# EAGLE design pecs_storm (EAGLE 6.5.0)
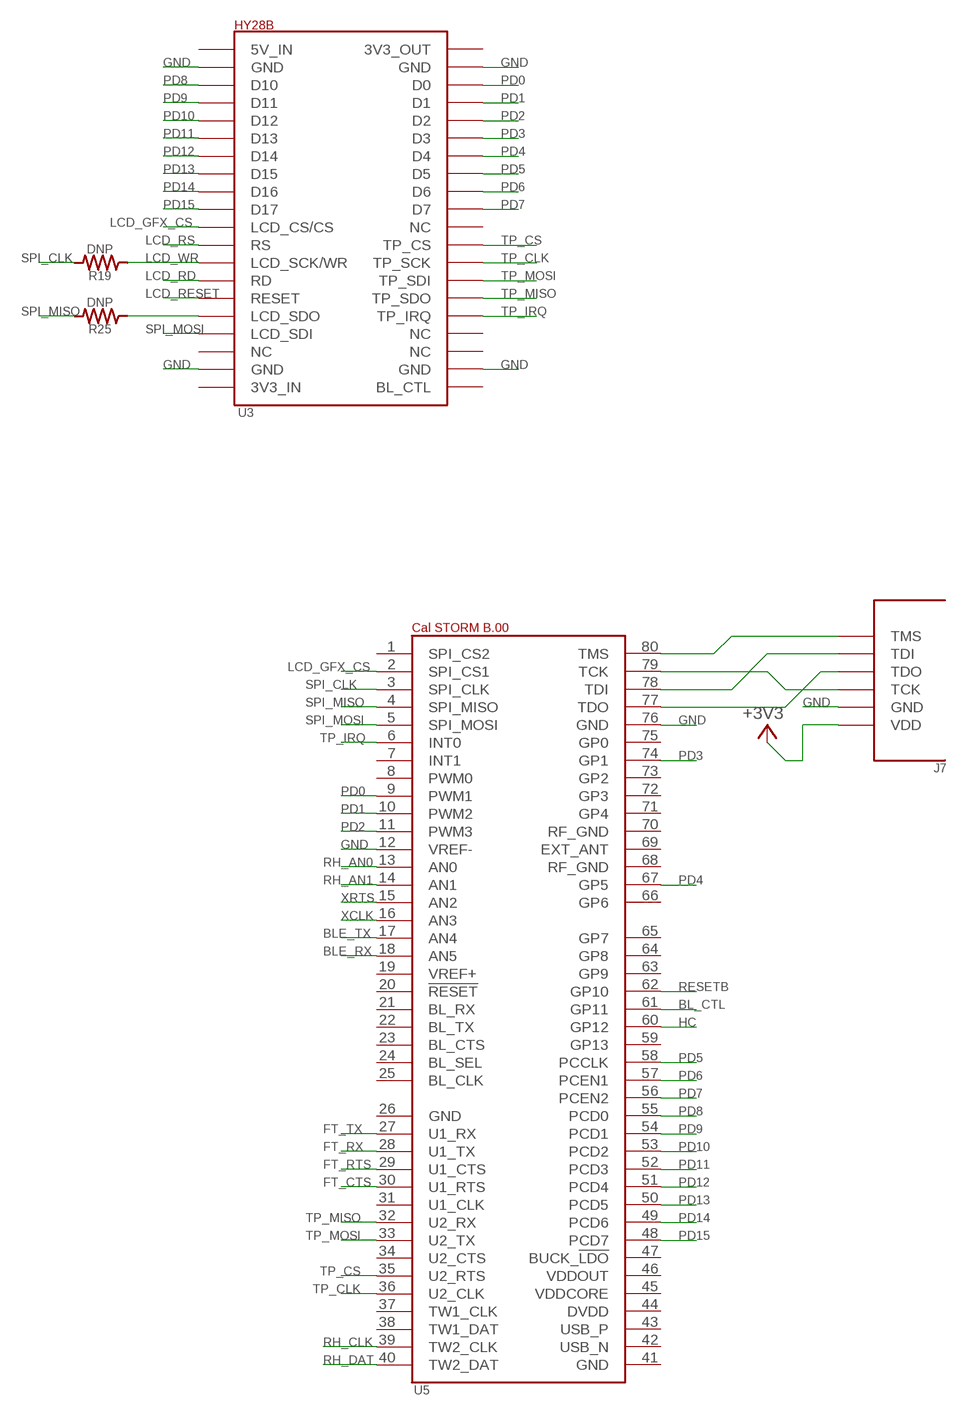
[diagram p0: schematic, sheet 1, part 1 of 2]
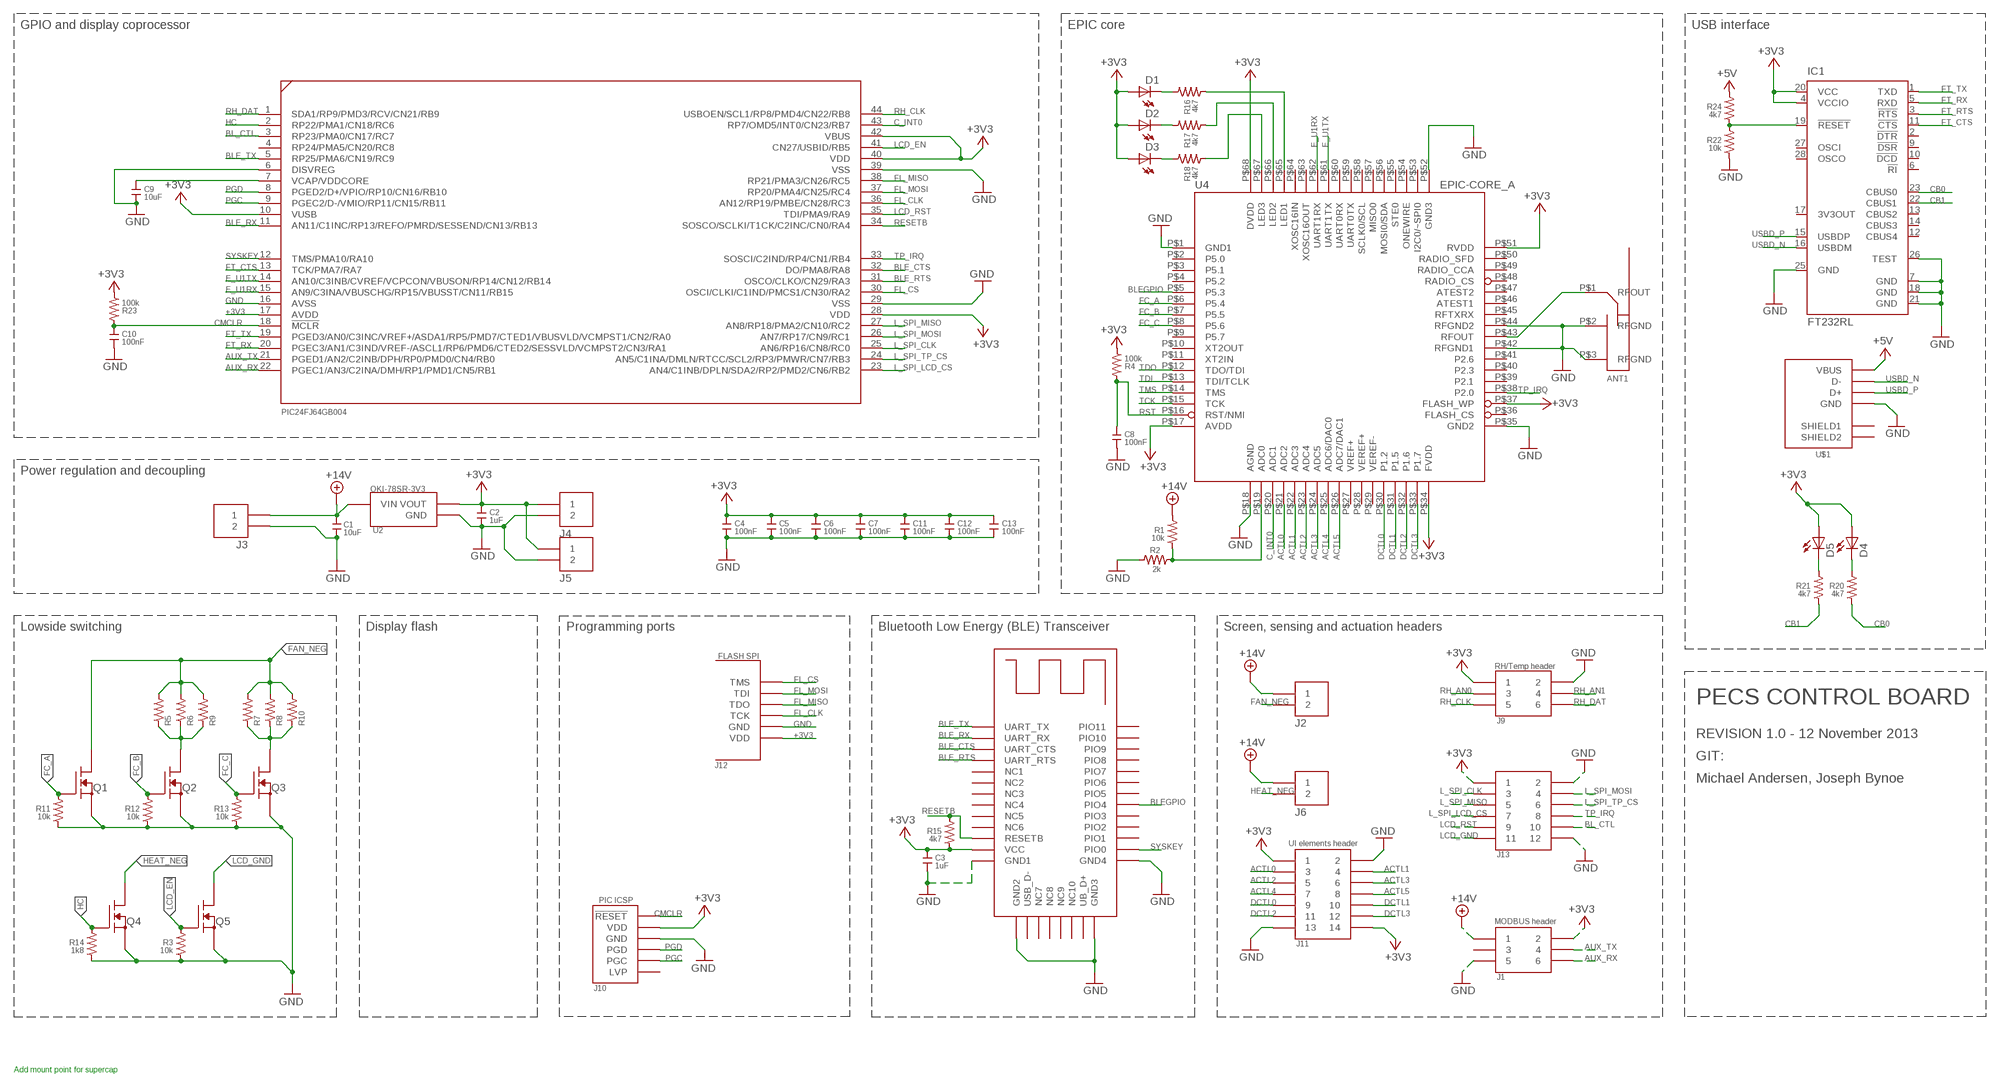
[diagram p1: schematic, sheet 1, part 2 of 2]

## Parts
ANT1  PIFA-2.4GHZ  [PIFA-2.4GHZ]
BLE1  HM10_BLE  [HM10]
C1  10uF  0805_CAPACITOR  [0805]
C2  1uF  0805_CAPACITOR  [0805]
C3  1uF  0805_CAPACITOR  [0805]
C4  100nF  0805_CAPACITOR  [0805]
C5  100nF  0805_CAPACITOR  [0805]
C6  100nF  0805_CAPACITOR  [0805]
C7  100nF  0805_CAPACITOR  [0805]
C8  100nF  0805_CAPACITOR  [0805]
C9  10uF  0805_CAPACITOR  [0805]
C10  100nF  0805_CAPACITOR  [0805]
C11  100nF  0805_CAPACITOR  [0805]
C12  100nF  0805_CAPACITOR  [0805]
C13  100nF  0805_CAPACITOR  [0805]
D1  LED1206  [LED-1206]
D2  LED1206  [LED-1206]
D3  LED1206  [LED-1206]
D4  LED1206  [LED-1206]
D5  LED1206  [LED-1206]
IC1  FT232RL  [SSOP28]
J1  HD.1-6  [HD.1-6]
J2  H.1-2  [H.1-2]
J3  H.1-2  [H.1-2]
J4  H.1-2  [H.1-2]
J5  H.1-2  [H.1-2]
J6  H.1-2  [H.1-2]
J7  JTAG  [JTAG]
J9  HD.1-6  [HD.1-6]
J10  ICSP_HDR  [H.1-6]
J11  HD.1-14  [HD.1-16]
J12  JTAG  [JTAG]
J13  HD.1-12  [HD.1-12]
Q1  NFET_DPAK  [DPAK]
Q2  NFET_DPAK  [DPAK]
Q3  NFET_DPAK  [DPAK]
Q4  NFET_DPAK  [DPAK]
Q5  NFET_DPAK  [DPAK]
R1  10k  0805_RESISTOR  [0805]
R2  2k  0805_RESISTOR  [0805]
R3  10k  0805_RESISTOR  [0805]
R4  100k  0805_RESISTOR  [0805]
R5  1206_RESISTOR  [1206]
R6  1206_RESISTOR  [1206]
R7  1206_RESISTOR  [1206]
R8  1206_RESISTOR  [1206]
R9  1206_RESISTOR  [1206]
R10  1206_RESISTOR  [1206]
R11  10k  0805_RESISTOR  [0805]
R12  10k  0805_RESISTOR  [0805]
R13  10k  0805_RESISTOR  [0805]
R14  1k8  0805_RESISTOR  [0805]
R15  4k7  0805_RESISTOR  [0805]
R16  4k7  0805_RESISTOR  [0805]
R17  4k7  0805_RESISTOR  [0805]
R18  4k7  0805_RESISTOR  [0805]
R19  DNP  0805_RESISTOR  [0805]
R20  4k7  0805_RESISTOR  [0805]
R21  4k7  0805_RESISTOR  [0805]
R22  10k  0805_RESISTOR  [0805]
R23  100k  0805_RESISTOR  [0805]
R24  4k7  0805_RESISTOR  [0805]
R25  DNP  0805_RESISTOR  [0805]
U1  PIC24FJ32GB004  [TQFP44]
U2  OKI-78SR_3V3_SMPS  [SMPS_MODULE]
U3  HY28B  [SCREEN]
U4  EPIC-CORE_A  [EPIC-LCC68]
U5  STORM_B.00  [STORM_LANDING]
U$1  USB_B  [USB_MOLEX_7041]

## Nets
+3V3: BLE1.P$12(VCC) C2.2 C3.2 C4.2 C5.2 C6.2 C7.2 C11.2 C12.2 C13.2 D1.A D2.A D3.A D4.A D5.A IC1.4(VCCIO) IC1.20(VCC) J1.P2 J4.P1 J5.P1 J7.VDD J9.P1 J10.P2(VDD) J11.P1 J11.P14 J12.VDD J13.P1 R4.1 R15.1 R23.1 U1.10(VUSB) U1.17(AVDD) U1.28(VDD) U1.40(VDD) U1.42(VBUS) U2.VOUT U4.P$17(AVDD) U4.P$34(FVDD) U4.P$37(FLASH_WP) U4.P$51(RVDD) U4.P$68(DVDD)
+5V: R24.2 U$1.1_VBUS(VBUS)
+14V: C1.2 J1.P1 J2.P1 J3.P1 J6.P1 R1.2 U2.VIN
ACTL0: J11.P3 U4.P$21(ADC2)
ACTL1: J11.P4 U4.P$22(ADC3)
ACTL2: J11.P5 U4.P$23(ADC4)
ACTL3: J11.P6 U4.P$24(ADC5)
ACTL4: J11.P7 U4.P$25(ADC6/DAC0)
ACTL5: J11.P8 U4.P$26(ADC7/DAC1)
AUX_RX: J1.P6 U1.22(PGEC1/AN3/C2INA/DMH/RP1/PMD1/CN5/RB1)
AUX_TX: J1.P4 U1.21(PGED1/AN2/C2INB/DPH/RP0/PMD0/CN4/RB0)
BL_CTL: J13.P10 U1.3(RP23/PMA0/CN17/RC7) U5.61(GP11)
BLE_CTS: BLE1.P$3(UART_CTS) U1.32(DO/PMA8/RA8)
BLE_RTS: BLE1.P$4(UART_RTS) U1.31(OSCO/CLKO/CN29/RA3)
BLE_RX: BLE1.P$2(UART_RX) U1.11(AN11/C1INC/RP13/REFO/PMRD/SESSEND/CN13/RB13) U5.18(AN5)
BLE_TX: BLE1.P$1(UART_TX) U1.5(RP25/PMA6/CN19/RC9) U5.17(AN4)
BLEGPIO: BLE1.P$27(PIO4) U4.P$5(P5.3)
C_INT0: U1.43(RP7/OMD5/INT0/CN23/RB7) U4.P$20(ADC1)
CB0: IC1.23(CBUS0) R20.1
CB1: IC1.22(CBUS1) R21.1
CMCLR: C10.2 J10.P1(!RESET!) R23.2 U1.18(!MCLR!)
DCTL0: J11.P9 U4.P$30(P1.2)
DCTL1: J11.P10 U4.P$31(P1.5)
DCTL2: J11.P11 U4.P$32(P1.6)
DCTL3: J11.P12 U4.P$33(P1.7)
E_U1RX: U1.15(AN9/C3INA/VBUSCHG/RP15/VBUSST/CN11/RB15) U4.P$62(UART1RX)
E_U1TX: U1.14(AN10/C3INB/CVREF/VCPCON/VBUSON/RP14/CN12/RB14) U4.P$61(UART1TX)
FAN_NEG: J2.P2 Q1.TAG(D) R5.2 R6.2 R7.2 R8.2 R9.2 R10.2
FC_A: Q1.P1(G) R11.2 U4.P$6(P5.4)
FC_B: Q2.P1(G) R12.2 U4.P$7(P5.5)
FC_C: Q3.P1(G) R13.2 U4.P$8(P5.6)
FL_CLK: J12.TCK U1.36(AN12/RP19/PMBE/CN28/RC3)
FL_CS: J12.TMS U1.30(OSCI/CLKI/C1IND/PMCS1/CN30/RA2)
FL_MISO: J12.TDO U1.38(RP21/PMA3/CN26/RC5)
FL_MOSI: J12.TDI U1.37(RP20/PMA4/CN25/RC4)
FT_CTS: IC1.11(!CTS) U1.13(TCK/PMA7/RA7) U5.30(U1_RTS)
FT_RTS: IC1.3(!RTS) U5.29(U1_CTS)
FT_RX: IC1.5(RXD) U1.20(PGEC3/AN1/C3IND/VREF-/ASCL1/RP6/PMD6/CTED2/SESSVLD/VCMPST2/CN3/RA1) U5.28(U1_TX)
FT_TX: IC1.1(TXD) U1.19(PGED3/AN0/C3INC/VREF+/ASDA1/RP5/PMD7/CTED1/VBUSVLD/VCMPST1/CN2/RA0) U5.27(U1_RX)
GND: ANT1.P$2(RFGND) ANT1.P$3(RFGND) BLE1.P$13(GND1) BLE1.P$14(GND2) BLE1.P$21(GND3) BLE1.P$22(GND4) C1.1 C2.1 C3.1 C4.1 C5.1 C6.1 C7.1 C8.1 C9.1 C10.1 C11.1 C12.1 C13.1 IC1.7(GND) IC1.18(GND) IC1.21(GND) IC1.25(GND) IC1.26(TEST) J1.P5 J3.P2 J4.P2 J5.P2 J7.GND J9.P2 J10.P3(GND) J11.P2 J11.P13 J12.GND J13.P2 J13.P12 Q1.P3(S) Q2.P3(S) Q3.P3(S) Q4.P3(S) Q5.P3(S) R2.1 R3.1 R11.1 R12.1 R13.1 R14.1 R22.1 U1.6(DISVREG) U1.16(AVSS) U1.29(VSS) U1.39(VSS) U2.GND U3.P$2(GND) U3.P$19(GND) U3.P$22(GND) U3.P$39(GND) U4.P$1(GND1) U4.P$18(AGND) U4.P$35(GND2) U4.P$42(RFGND1) U4.P$44(RFGND2) U4.P$52(GND3) U5.12(VREF-) U5.76(GND) U$1.4_GND(GND)
HC: Q4.P1(G) R14.2 U1.2(RP22/PMA1/CN18/RC6) U5.60(GP12)
HEAT_NEG: J6.P2 Q4.TAG(D)
L_SPI_CLK: J13.P3 U1.25(AN6/RP16/CN8/RC0)
L_SPI_LCD_CS: J13.P7 U1.23(AN4/C1INB/DPLN/SDA2/RP2/PMD2/CN6/RB2)
L_SPI_MISO: J13.P5 U1.27(AN8/RP18/PMA2/CN10/RC2)
L_SPI_MOSI: J13.P4 U1.26(AN7/RP17/CN9/RC1)
L_SPI_TP_CS: J13.P6 U1.24(AN5/C1INA/DMLN/RTCC/SCL2/RP3/PMWR/CN7/RB3)
LCD_EN: Q5.P1(G) R3.2 U1.41(CN27/USBID/RB5)
LCD_GFX_CS: U3.P$11(LCD_CS/CS) U5.2(SPI_CS1)
LCD_GND: J13.P11 Q5.TAG(D)
LCD_RD: U3.P$14(RD)
LCD_RESET: U3.P$15(RESET)
LCD_RS: U3.P$12(RS)
LCD_RST: J13.P9 U1.35(TDI/PMA9/RA9)
LCD_WR: R19.2 U3.P$13(LCD_SCK/WR)
N$1: C9.2 U1.7(VCAP/VDDCORE)
N$2: R25.2 U3.P$16(LCD_SDO)
N$3: ANT1.P$1(RFOUT) U4.P$43(RFOUT)
N$4: J7.TMS U5.80(TMS)
N$5: J7.TCK U5.79(TCK)
N$6: Q2.TAG(D) R5.1 R6.1 R9.1
N$7: Q3.TAG(D) R7.1 R8.1 R10.1
N$8: J7.TDI U5.78(TDI)
N$9: D4.C R20.2
N$10: D1.C R16.2
N$11: D2.C R17.2
N$12: D3.C R18.2
N$13: R16.1 U4.P$65(LED1)
N$14: D5.C R21.2
N$15: R17.1 U4.P$66(LED2)
N$16: R18.1 U4.P$67(LED3)
N$17: J7.TDO U5.77(TDO)
N$19: IC1.19(!RESET) R22.2 R24.1
N$23: R1.1 R2.2 U4.P$19(ADC0)
PD0: U3.P$38(D0) U5.9(PWM1)
PD1: U3.P$37(D1) U5.10(PWM2)
PD2: U3.P$36(D2) U5.11(PWM3)
PD3: U3.P$35(D3) U5.74(GP1)
PD4: U3.P$34(D4) U5.67(GP5)
PD5: U3.P$33(D5) U5.58(PCCLK)
PD6: U3.P$32(D6) U5.57(PCEN1)
PD7: U3.P$31(D7) U5.56(PCEN2)
PD8: U3.P$3(D10) U5.55(PCD0)
PD9: U3.P$4(D11) U5.54(PCD1)
PD10: U3.P$5(D12) U5.53(PCD2)
PD11: U3.P$6(D13) U5.52(PCD3)
PD12: U3.P$7(D14) U5.51(PCD4)
PD13: U3.P$8(D15) U5.50(PCD5)
PD14: U3.P$9(D16) U5.49(PCD6)
PD15: U3.P$10(D17) U5.48(PCD7)
PGC: J10.P5(PGC) U1.9(PGEC2/D-/VMIO/RP11/CN15/RB11)
PGD: J10.P4(PGD) U1.8(PGED2/D+/VPIO/RP10/CN16/RB10)
RESETB: BLE1.P$11(RESETB) R15.2 U1.34(SOSCO/SCLKI/T1CK/C2INC/CN0/RA4) U5.62(GP10)
RH_AN0: J9.P3 U5.13(AN0)
RH_AN1: J9.P4 U5.14(AN1)
RH_CLK: J9.P5 U1.44(USBOEN/SCL1/RP8/PMD4/CN22/RB8) U5.39(TW2_CLK)
RH_DAT: J9.P6 U1.1(SDA1/RP9/PMD3/RCV/CN21/RB9) U5.40(TW2_DAT)
RST: C8.2 R4.2 U4.P$16(RST/NMI)
SPI_CLK: R19.1 U5.3(SPI_CLK)
SPI_MISO: R25.1 U5.4(SPI_MISO)
SPI_MOSI: U3.P$17(LCD_SDI) U5.5(SPI_MOSI)
SYSKEY: BLE1.P$23(PIO0) U1.12(TMS/PMA10/RA10)
TCK: U4.P$15(TCK)
TDI: U4.P$13(TDI/TCLK)
TDO: U4.P$12(TDO/TDI)
TMS: U4.P$14(TMS)
TP_CLK: U3.P$28(TP_SCK) U5.36(U2_CLK)
TP_CS: U3.P$29(TP_CS) U5.35(U2_RTS)
TP_IRQ: J13.P8 U1.33(SOSCI/C2IND/RP4/CN1/RB4) U3.P$25(TP_IRQ) U4.P$38(P2.0) U5.6(INT0)
TP_MISO: U3.P$26(TP_SDO) U5.32(U2_RX)
TP_MOSI: U3.P$27(TP_SDI) U5.33(U2_TX)
USBD_N: IC1.16(USBDM) U$1.2_D-(D-)
USBD_P: IC1.15(USBDP) U$1.3_D+(D+)
XCLK: U5.16(AN3)
XRTS: U5.15(AN2)
Unconnected: BLE1.P$5(NC1) BLE1.P$6(NC2) BLE1.P$7(NC3) BLE1.P$8(NC4) BLE1.P$9(NC5) BLE1.P$10(NC6) BLE1.P$15(USB_D-) BLE1.P$16(NC7) BLE1.P$17(NC8) BLE1.P$18(NC9) BLE1.P$19(NC10) BLE1.P$20(UB_D+) BLE1.P$24(PIO1) BLE1.P$25(PIO2) BLE1.P$26(PIO3) BLE1.P$28(PIO5) BLE1.P$29(PIO6) BLE1.P$30(PIO7) BLE1.P$31(PIO8) BLE1.P$32(PIO9) BLE1.P$33(PIO10) BLE1.P$34(PIO11) IC1.2(!DTR) IC1.6(!RI) IC1.9(!DSR) IC1.10(!DCD) IC1.12(CBUS4) IC1.13(CBUS2) IC1.14(CBUS3) IC1.17(3V3OUT) IC1.27(OSCI) IC1.28(OSCO) J1.P3 J10.P6(LVP) U1.4(RP24/PMA5/CN20/RC8) U3.P$1(5V_IN) U3.P$18(NC) U3.P$20(3V3_IN) U3.P$21(BL_CTL) U3.P$23(NC) U3.P$24(NC) U3.P$30(NC) U3.P$40(3V3_OUT) U4.P$2(P5.0) U4.P$3(P5.1) U4.P$4(P5.2) U4.P$9(P5.7) U4.P$10(XT2OUT) U4.P$11(XT2IN) U4.P$27(VREF+) U4.P$28(VEREF+) U4.P$29(VEREF-) U4.P$36(FLASH_CS) U4.P$39(P2.1) U4.P$40(P2.3) U4.P$41(P2.6) U4.P$45(RFTXRX) U4.P$46(ATEST1) U4.P$47(ATEST2) U4.P$48(RADIO_CS) U4.P$49(RADIO_CCA) U4.P$50(RADIO_SFD) U4.P$53(I2C0/~SPI0) U4.P$54(ONEWIRE) U4.P$55(STE0) U4.P$56(MOSI0/SDA) U4.P$57(MISO0) U4.P$58(SCLK0/SCL) U4.P$59(UART0TX) U4.P$60(UART0RX) U4.P$63(XOSC16OUT) U4.P$64(XOSC16IN) U5.1(SPI_CS2) U5.7(INT1) U5.8(PWM0) U5.19(VREF+) U5.20(!RESET!) U5.21(BL_RX) U5.22(BL_TX) U5.23(BL_CTS) U5.24(BL_SEL) U5.25(BL_CLK) U5.26(GND) U5.31(U1_CLK) U5.34(U2_CTS) U5.37(TW1_CLK) U5.38(TW1_DAT) U5.41(GND) U5.42(USB_N) U5.43(USB_P) U5.44(DVDD) U5.45(VDDCORE) U5.46(VDDOUT) U5.47(BUCK_!LDO!) U5.59(GP13) U5.63(GP9) U5.64(GP8) U5.65(GP7) U5.66(GP6) U5.68(RF_GND) U5.69(EXT_ANT) U5.70(RF_GND) U5.71(GP4) U5.72(GP3) U5.73(GP2) U5.75(GP0) U$1.SHIELD1 U$1.SHIELD2

## Notes on the sheet
- GPIO and display coprocessor | EPIC core | USB interface
- PIC24FJ64GB004
- Power regulation and decoupling
- Lowside switching | Display flash | Programming ports | Bluetooth Low Energy (BLE) Transceiver | Screen, sensing and actuation headers
- FLASH SPI
- RH/Temp header
- PECS CONTROL BOARD
- REVISION 1.0 - 12 November 2013
- GIT:
- Michael Andersen, Joseph Bynoe
- UI elements header
- PIC ICSP
- MODBUS header
- Add mount point for supercap

## Library data of the parts
ANT1 = berkeley-epic:PIFA-2.4GHZ
BLE1 = pecs:HM10_BLE
C1-C13 = pecs:0805_CAPACITOR
D1-D5 = berkeley-epic:LED: LEDs Standard schematic elements and footprints for 5mm, 3mm, 1206, and 0603 sized LEDs. 5mm - Spark Fun Electronics SKU : COM-00529 (and others)
IC1 = ftdichip:FT232R: Source: http://www.ftdichip.com/Documents/DataSheets/DS_FT232R_v104.pdf; MPN: FT232RL; OC_FARNELL: 1146032; OC_NEWARK: 91K9918
J1 J9 = pecs:HD.1-6
J2-J6 = pecs:H.1-2
J7 J12 = pecs:JTAG
J10 = pecs:ICSP_HDR
J11 = pecs:HD.1-14
J13 = pecs:HD.1-12
Q1-Q5 = pecs:NFET_DPAK
R1-R4 R11-R25 = pecs:0805_RESISTOR
R5-R10 = pecs:1206_RESISTOR
U1 = pecs:PIC24FJ32GB004
U2 = pecs:OKI-78SR_3V3_SMPS
U3 = pecs:HY28B
U4 = berkeley-epic:EPIC-CORE_A
U5 = storm:STORM_B.00
U$1 = pecs:USB_B

## Board
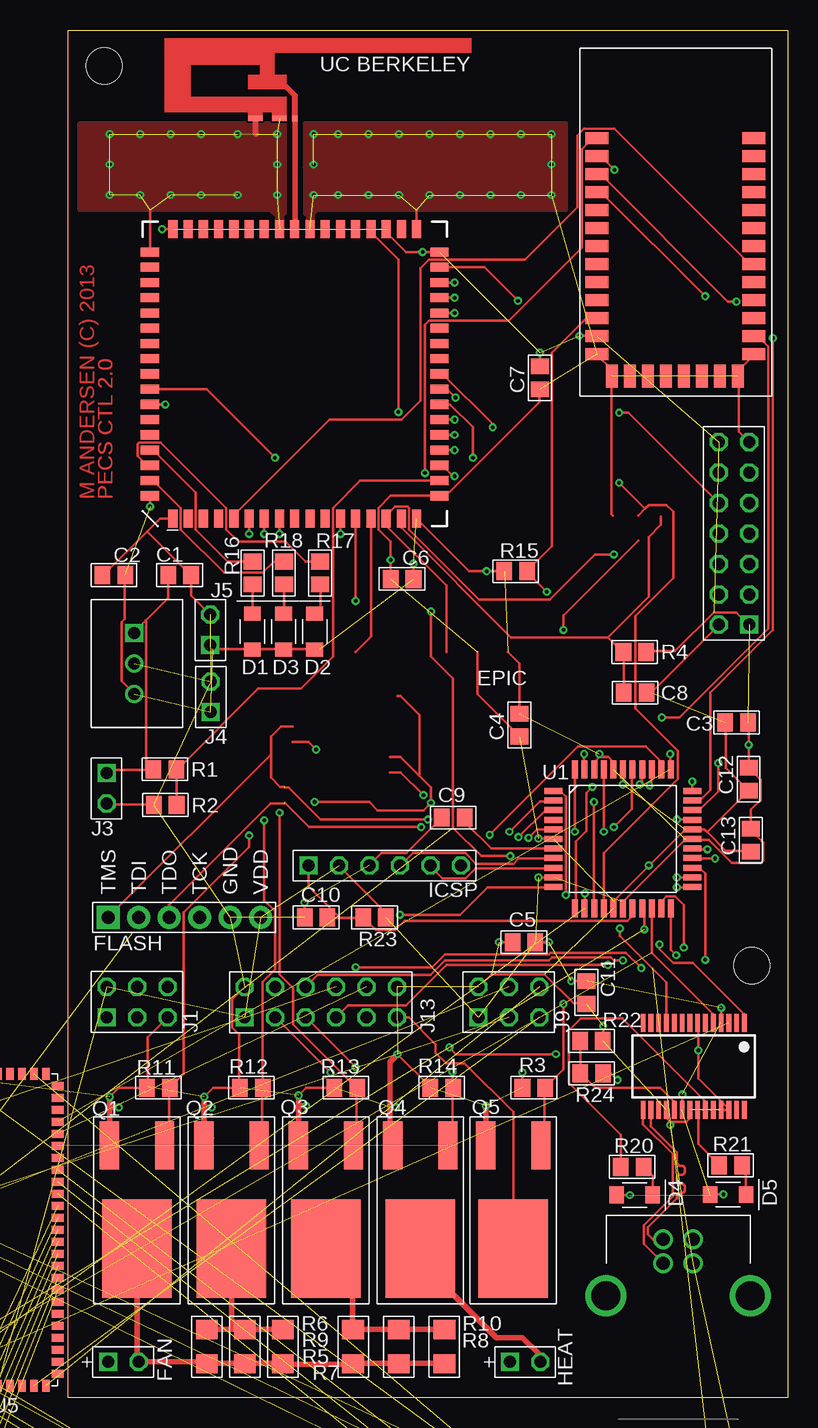
[diagram p2: board, top side]
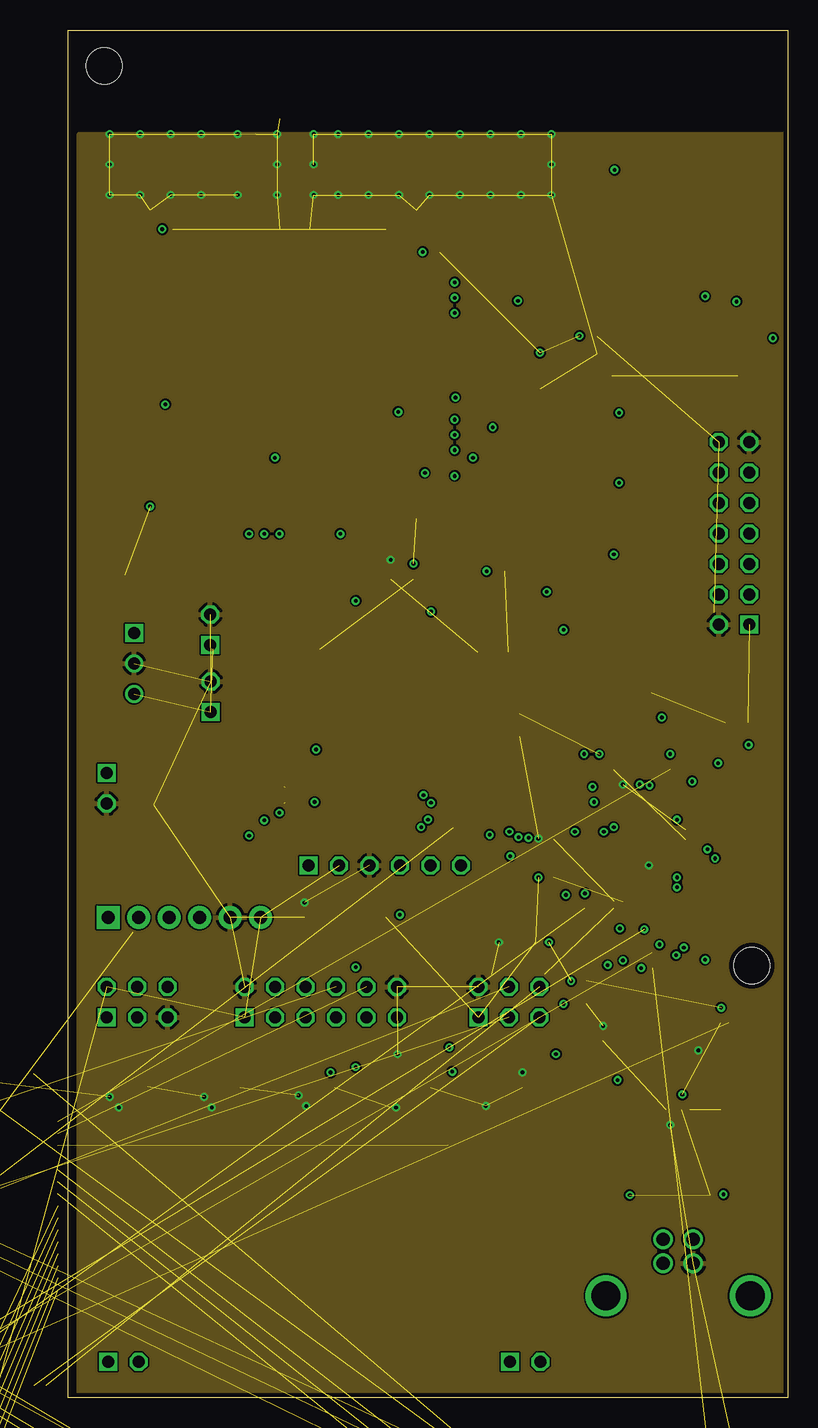
[diagram p3: board, inner layer Route2]
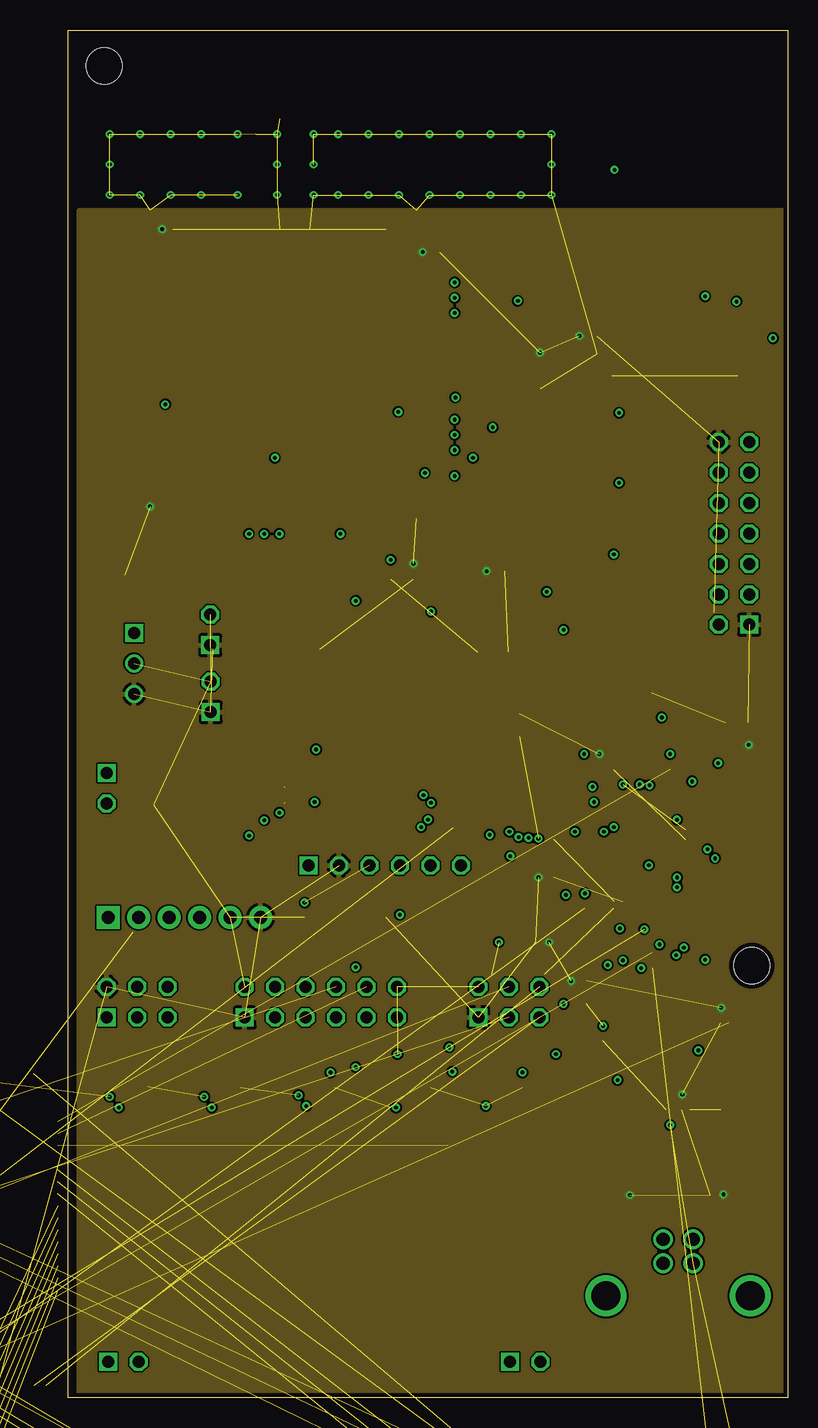
[diagram p4: board, inner layer Route15]
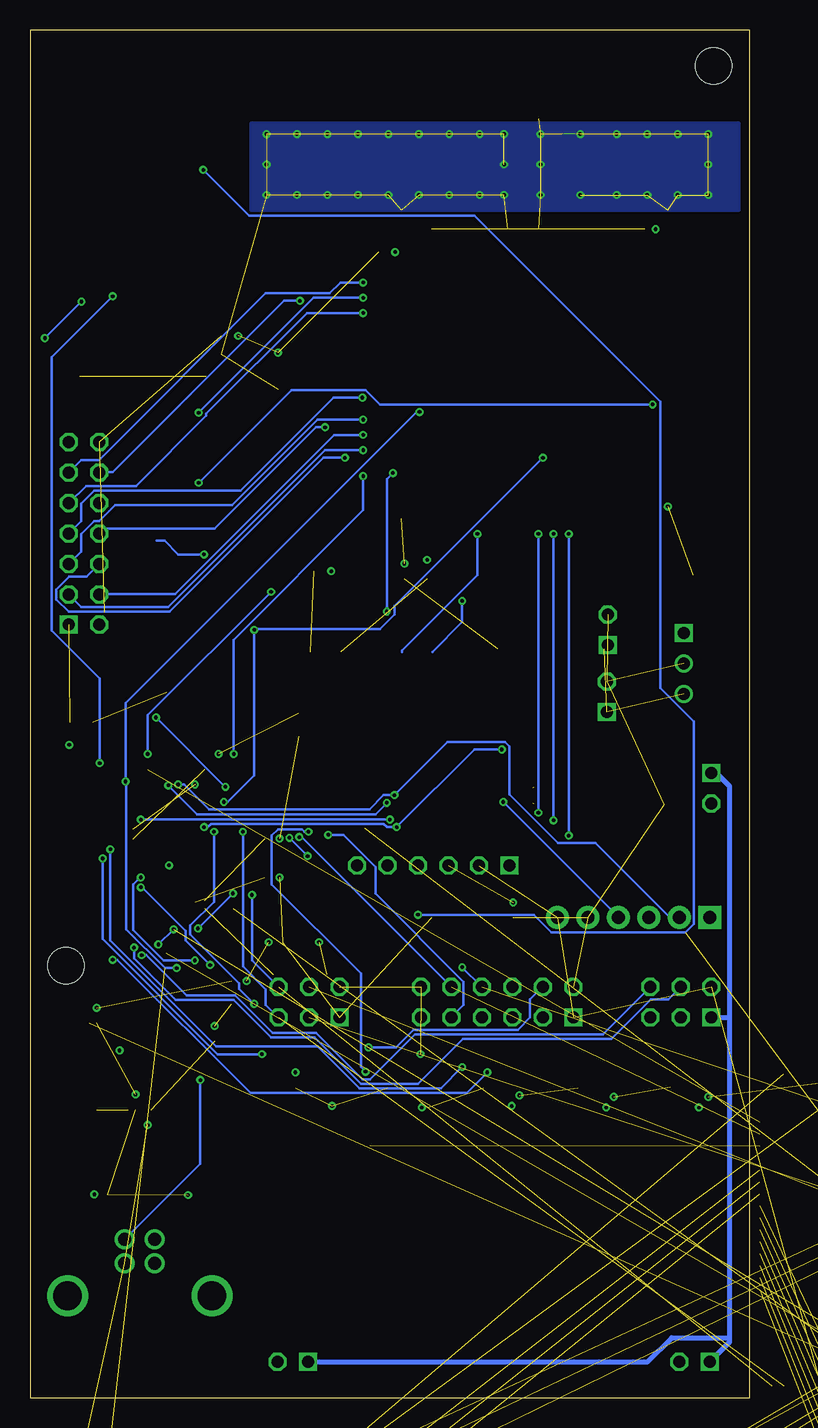
[diagram p5: board, bottom side, seen from below]

Size 60 x 114 mm. Coordinates in mm from the lower left corner, seen from the top.
Outline: 0,114 60,114 60,0 0,0 0,114
Copper layers (1*2*15*16): Top 0.0356mm / dielectric 1.5011mm / Route2 0.0356mm / dielectric 0.1499mm / Route15 0.0356mm / dielectric 0.2007mm / Bottom 0.0356mm
Design rules "designrules *": minimum track width 8mil, minimum drill 12mil, track to track 6mil, track to pad 6mil, pad to pad 6mil, via to via 6mil, smd to smd 0mil, copper to edge 15mil, drill to drill 6mil, minimum pad ring 7mil, minimum via ring 7mil, stop-mask expansion 3mil, vias tented up to drill 12mil, thermal gap 10mil
Holes 3 mm at 3,111 57,36
vRestrict: area 178.7,54 to 185.1,70.3

### Footprints (pad centres in the part's own frame; a part is rotated, then mirrored left to right if it is on the bottom)
PIFA-2.4GHZ = smd 0.46 x 0.46: P$1 -2.65,-1.495 | smd 0.46 x 1.2: P$2 -2.655,1.785; P$3 -2.65,-0.215
HM10 = smd 1.9 x 1: P$1 -13.1,18; P$2 -13.1,16.5; P$3 -13.1,15; P$4 -13.1,13.5; P$5 -13.1,12; P$6 -13.1,10.5; P$7 -13.1,9; P$8 -13.1,7.5; P$9 -13.1,6; P$10 -13.1,4.5; P$11 -13.1,3; P$12 -13.1,1.5; P$13 -13.1,0; P$22 0,0; P$23 0,1.5; P$24 0,3; P$25 0,4.5; P$26 0,6; P$27 0,7.5; P$28 0,9; P$29 0,10.5; P$30 0,12; P$31 0,13.5; P$32 0,15; P$33 0,16.5; P$34 0,18 | smd 1 x 1.9: P$14 -11.85,-1.84; P$15 -10.35,-1.84; P$16 -8.85,-1.84; P$17 -7.35,-1.84; P$18 -5.85,-1.84; P$19 -4.35,-1.84; P$20 -2.85,-1.84; P$21 -1.35,-1.84
0805 = smd 1.3 x 1.5: 1 -0.95,0; 2 0.95,0
LED-1206 = smd 1.2 x 1.4: A -1.5,0; C 1.5,0
SSOP28 = smd 0.4 x 1.5: 1 -4.225,-3.625; 2 -3.575,-3.625; 3 -2.925,-3.625; 4 -2.275,-3.625; 5 -1.625,-3.625; 6 -0.975,-3.625; 7 -0.325,-3.625; 8 0.325,-3.625; 9 0.975,-3.625; 10 1.625,-3.625; 11 2.275,-3.625; 12 2.925,-3.625; 13 3.575,-3.625; 14 4.225,-3.625; 15 4.225,3.625; 16 3.575,3.625; 17 2.925,3.625; 18 2.275,3.625; 19 1.625,3.625; 20 0.975,3.625; 21 0.325,3.625; 22 -0.325,3.625; 23 -0.975,3.625; 24 -1.625,3.625; 25 -2.275,3.625; 26 -2.925,3.625; 27 -3.575,3.625; 28 -4.225,3.625
HD.1-6 = drill 1 square: P1 0,0 | drill 1 octagon: P2 0,2.54; P3 2.54,0; P4 2.54,2.54; P5 5.08,0; P6 5.08,2.54
H.1-2 = drill 1 square: P1 0,0 | drill 1 octagon: P2 2.54,0
JTAG = drill 1.1 pad 1.9: GND 0,-10.16; TCK 0,-7.62; TDI 0,-2.54; TDO 0,-5.08; VDD 0,-12.7 | drill 1.1 pad 1.9 square: TMS 0,0
H.1-6 = drill 1 square: P1 -7.62,-1.27 | drill 1 octagon: P2 -5.08,-1.27; P3 -2.54,-1.27; P4 0,-1.27; P5 2.54,-1.27; P6 5.08,-1.27
HD.1-16 = drill 1 square: P1 0,0 | drill 1 octagon: P2 0,2.54; P3 2.54,0; P4 2.54,2.54; P5 5.08,0; P6 5.08,2.54; P7 7.62,0; P8 7.62,2.54; P9 10.16,0; P10 10.16,2.54; P11 12.7,0; P12 12.7,2.54; P13 15.24,0; P14 15.24,2.54
HD.1-12 = drill 1 square: P1 -6.35,-1.27 | drill 1 octagon: P2 -6.35,1.27; P3 -3.81,-1.27; P4 -3.81,1.27; P5 -1.27,-1.27; P6 -1.27,1.27; P7 1.27,-1.27; P8 1.27,1.27; P9 3.81,-1.27; P10 3.81,1.27; P11 6.35,-1.27; P12 6.35,1.27
DPAK = smd 1.6 x 4: P1 -2.3,0; P3 2.3,0 | smd 5.8 x 8.2: TAG 0,8.6
1206 = smd 1.6 x 1.803: 1 -1.422,0; 2 1.422,0
TQFP44 = smd 1.5 x 0.5: 1 -5.8,4; 2 -5.8,3.2; 3 -5.8,2.4; 4 -5.8,1.6; 5 -5.8,0.8; 6 -5.8,0; 7 -5.8,-0.8; 8 -5.8,-1.6; 9 -5.8,-2.4; 10 -5.8,-3.2; 11 -5.8,-4; 23 5.8,-4; 24 5.8,-3.2; 25 5.8,-2.4; 26 5.8,-1.6; 27 5.8,-0.8; 28 5.8,0; 29 5.8,0.8; 30 5.8,1.6; 31 5.8,2.4; 32 5.8,3.2; 33 5.8,4 | smd 0.5 x 1.5: 12 -4,-5.8; 13 -3.2,-5.8; 14 -2.4,-5.8; 15 -1.6,-5.8; 16 -0.8,-5.8; 17 0,-5.8; 18 0.8,-5.8; 19 1.6,-5.8; 20 2.4,-5.8; 21 3.2,-5.8; 22 4,-5.8; 34 4,5.8; 35 3.2,5.8; 36 2.4,5.8; 37 1.6,5.8; 38 0.8,5.8; 39 0,5.8; 40 -0.8,5.8; 41 -1.6,5.8; 42 -2.4,5.8; 43 -3.2,5.8; 44 -4,5.8
SMPS_MODULE = drill 1: GND 0,0; VOUT 2.54,0 | drill 1 square: VIN -2.54,0
SCREEN = drill 0.8 square: P$1 0,0 | drill 0.8: P$2 0,-2; P$3 0,-4; P$4 0,-6; P$5 0,-8; P$6 0,-10; P$7 0,-12; P$8 0,-14; P$9 0,-16; P$10 0,-18; P$11 0,-20; P$12 0,-22; P$13 0,-24; P$14 0,-26; P$15 0,-28; P$16 0,-30; P$17 0,-32; P$18 0,-34; P$19 0,-36; P$20 0,-38; P$21 74,-38; P$22 74,-36; P$23 74,-34; P$24 74,-32; P$25 74,-30; P$26 74,-28; P$27 74,-26; P$28 74,-24; P$29 74,-22; P$30 74,-20; P$31 74,-18; P$32 74,-16; P$33 74,-14; P$34 74,-12; P$35 74,-10; P$36 74,-8; P$37 74,-6; P$38 74,-4; P$39 74,-2; P$40 74,0
EPIC-LCC68 = smd 1.524 x 0.762: P$1 -12.065,10.16; P$2 -12.065,8.89; P$3 -12.065,7.62; P$4 -12.065,6.35; P$5 -12.065,5.08; P$6 -12.065,3.81; P$7 -12.065,2.54; P$8 -12.065,1.27; P$9 -12.065,0; P$10 -12.065,-1.27; P$11 -12.065,-2.54; P$12 -12.065,-3.81; P$13 -12.065,-5.08; P$14 -12.065,-6.35; P$15 -12.065,-7.62; P$16 -12.065,-8.89; P$17 -12.065,-10.16; P$35 12.065,-10.16; P$36 12.065,-8.89; P$37 12.065,-7.62; P$38 12.065,-6.35; P$39 12.065,-5.08; P$40 12.065,-3.81; P$41 12.065,-2.54; P$42 12.065,-1.27; P$43 12.065,0; P$44 12.065,1.27; P$45 12.065,2.54; P$46 12.065,3.81; P$47 12.065,5.08; P$48 12.065,6.35; P$49 12.065,7.62; P$50 12.065,8.89; P$51 12.065,10.16 | smd 0.762 x 1.524: P$18 -10.16,-12.065; P$19 -8.89,-12.065; P$20 -7.62,-12.065; P$21 -6.35,-12.065; P$22 -5.08,-12.065; P$23 -3.81,-12.065; P$24 -2.54,-12.065; P$25 -1.27,-12.065; P$26 0,-12.065; P$27 1.27,-12.065; P$28 2.54,-12.065; P$29 3.81,-12.065; P$30 5.08,-12.065; P$31 6.35,-12.065; P$32 7.62,-12.065; P$33 8.89,-12.065; P$34 10.16,-12.065; P$52 10.16,12.065; P$53 8.89,12.065; P$54 7.62,12.065; P$55 6.35,12.065; P$56 5.08,12.065; P$57 3.81,12.065; P$58 2.54,12.065; P$59 1.27,12.065; P$60 0,12.065; P$61 -1.27,12.065; P$62 -2.54,12.065; P$63 -3.81,12.065; P$64 -5.08,12.065; P$65 -6.35,12.065; P$66 -7.62,12.065; P$67 -8.89,12.065; P$68 -10.16,12.065
STORM_LANDING = smd 1 x 0.65: 1 0,-1; 2 0,-2; 3 0,-3; 4 0,-4; 5 0,-5; 6 0,-6; 7 0,-7; 8 0,-8; 9 0,-9; 10 0,-10; 11 0,-11; 12 0,-12; 13 0,-13; 14 0,-14; 15 0,-15; 16 0,-16; 17 0,-17; 18 0,-18; 19 0,-19; 20 0,-20; 21 0,-21; 22 0,-22; 23 0,-23; 24 0,-24; 25 0,-25; 41 16,-25; 42 16,-24; 43 16,-23; 44 16,-22; 45 16,-21; 46 16,-20; 47 16,-19; 48 16,-18; 49 16,-17; 50 16,-16; 51 16,-15; 52 16,-14; 53 16,-13; 54 16,-12; 55 16,-11; 56 16,-10; 57 16,-9; 58 16,-8; 59 16,-7; 60 16,-6; 61 16,-5; 62 16,-4; 63 16,-3; 64 16,-2; 65 16,-1 | smd 0.65 x 1: 26 1,-26; 27 2,-26; 28 3,-26; 29 4,-26; 30 5,-26; 31 6,-26; 32 7,-26; 33 8,-26; 34 9,-26; 35 10,-26; 36 11,-26; 37 12,-26; 38 13,-26; 39 14,-26; 40 15,-26; 66 15,0; 67 14,0; 68 13,0; 69 12,0; 70 11,0; 71 10,0; 72 9,0; 73 8,0; 74 7,0; 75 6,0; 76 5,0; 77 4,0; 78 3,0; 79 2,0; 80 1,0
USB_MOLEX_7041 = drill 1.1: 1_VBUS 1.25,0; 2_D- -1.25,0; 3_D+ -1.25,-2; 4_GND 1.25,-2 | drill 2.4: SHIELD1 -6.02,-4.71; SHIELD2 6.02,-4.71

### Placement (x,y rotation side)
ANT1  17.39,109.27 90 top
BLE1  57.17,86.97 0 top
C1  9.29,68.56 180 top
C2  3.81,68.56 0 top
C3  55.72,56.26 0 top
C4  37.61,56.05 90 top
C5  37.99,37.96 0 top
C6  27.83,68.25 0 top
C7  39.32,84.99 90 top
C8  47.26,58.76 180 top
C9  32.09,48.34 0 top
C10  20.66,40.02 0 top
C11  43.2,33.77 90 top
C12  56.73,51.55 90 top
C13  56.92,46.47 90 top
D1  15.34,63.86 90 top
D2  20.54,63.86 90 top
D3  17.95,63.86 90 top
D4  47.23,16.89 0 top
D5  55.02,16.91 0 top
IC1  52.15,27.61 180 top
J1  3.2,31.7 0 top
J2  3.32,2.97 0 top
J3  3.2,52.05 270 top
J4  11.88,57.13 90 top
J5  11.83,62.72 90 top
J6  36.83,2.97 0 top
J7  -23.73,-51.13 0 top  (outside the outline)
J9  34.2,31.69 0 top
J10  27.64,45.61 0 top
J11  56.76,64.42 90 top
J12  3.32,40.02 90 top
J13  21.05,32.95 0 top
Q1  5.74,21 180 top
Q2  13.61,21 180 top
Q3  21.48,21 180 top
Q4  29.36,21 180 top
Q5  37.1,21 180 top
R1  8.06,52.37 180 top
R2  8.09,49.39 0 top
R3  38.82,25.83 0 top
R4  47.23,62.16 180 top
R5  11.55,4.24 270 top
R6  17.9,4.24 270 top
R7  23.74,4.24 270 top
R8  31.36,4.24 270 top
R9  14.73,4.24 270 top
R10  27.55,4.24 270 top
R11  7.51,25.83 0 top
R12  15.26,25.83 0 top
R13  23.13,25.83 0 top
R14  31.14,25.83 0 top
R15  37.3,68.88 0 top
R16  15.37,68.73 270 top
R17  20.99,68.73 270 top
R18  17.97,68.73 270 top
R19  -15.85,-60.15 0 top  (outside the outline)
R20  47.01,19.22 0 top
R21  55.23,19.36 0 top
R22  43.62,29.71 180 top
R23  25.54,40.01 180 top
R24  43.65,27.03 0 top
R25  -15.85,-64.22 0 top  (outside the outline)
U1  46.25,46.56 0 top
U2  5.48,61.2 270 top
U3  -16.23,-12.53 0 top  (outside the outline)
U4  18.88,85.33 90 top
U5  -16.87,26.97 0 top
U$1  50.85,13.19 0 top

### Tracks (layer width: path | path; a pad name or v marks a point on that pad's centre or on a via)
+3V3  (via drill 0.3)  (27 unrouted)
  Top 0.203: C3.2 56.73,56.24 v56.73,54.4 C12.2 56.79,52.43 57.74,51.48 57.74,49.83 56.92,49.01 C13.2 56.98,47.35 56.98,47.23 57.93,46.27 57.93,44.75 57.74,44.56 55.33,44.56 53.42,46.47 52.09,46.47 U1.28 52.03,46.53 51.46,46.53 46.25,41.32 U1.17 | U4.P$17 33.42,68.88 v34.88,68.88 R15.1 | U4.P$34 v29.55,95.49 28.15,95.49 26.5,97.14 U4.P$37 | D2.A 20.98,62.4 17.99,62.4 D3.A 17.93,62.4 15.39,62.4 D1.A 15.26,62.4 12.09,62.4 11.83,62.66 J5.P1 | 44.28,53.39 43.9,53.01 43.9,52.37 U1.42 | 44.28,53.39 45.04,53.39 45.42,53.01 45.42,52.37 U1.40 | v46.82,16.87 45.74,16.87 D4.A | v54.63,16.94 53.55,16.94 D5.A | R23.1 26.44,40.05 26.44,40.43 22.56,44.31 J10.P2 | C4.2 37.61,61.2 36.66,62.15 | v51.2,25.26 51.2,23.99 IC1.20 | v54.44,32.5 54.44,31.29 IC1.4 | v40.09,37.96 C5.2 | v39.2,43.35 40.41,43.35 U1.10 | v41.93,34.72 C11.2 | v28.79,69.52 C6.2 | C2.2 4.72,68.56 4.72,64.88 4.47,64.63 4.47,59.74 5.48,58.72 U2.VOUT | R4.1 48.22,62.21 50.57,62.21 53.81,65.45 55.71,65.45 56.73,64.44 J11.P1 | v39.33,87.11 39.33,85.96 C7.2 | v6.82,74.28 U4.P$68 | v7.83,97.39 U4.P$51 | v42.63,88.5 44.03,88.5 BLE1.P$12 | v44.28,53.64 44.28,53.39
  pour Route15: 0.91,98.98 60.6,98.98 60.6,-0.08 0.91,-0.08
+5V  (via drill 0.3)
  Top 0.203: R24.2 45.23,27.04 v45.8,26.46
  Bottom 0.203: v45.8,26.46 45.8,19.48 U$1.1_VBUS
+14V
  Top 0.203: J3.P1 3.2,52.12 3.39,52.31 7.07,52.31 R1.2 6.5,52.37 6.5,64.69 6.43,64.75 | 6.43,64.75 5.48,63.8 U2.VIN | 6.43,64.75 8.34,66.66 C1.2
  Bottom 0.406: J3.P1 2.75,52.05 1.67,50.97 1.67,31.67 | 1.67,31.67 1.67,4.87 | 1.67,4.87 1.67,4.62 J2.P1 | J1.P1 1.7,31.7 1.67,31.67 | J6.P1 8.53,2.97 6.5,5 1.8,5 1.67,4.87
ACTL0  (via drill 0.3)
  Top 0.203: v32.22,78.98 U4.P$21
  Bottom 0.203: v32.22,78.98 35.39,78.98 48.47,65.9 55.71,65.9 56.73,66.91 J11.P3
ACTL1  (via drill 0.3)
  Top 0.203: v32.22,80.25 U4.P$22
  Bottom 0.203: v32.22,80.25 34.63,80.25 47.9,66.98 54.19,66.98 J11.P4
ACTL2  (via drill 0.3)
  Top 0.203: v32.22,81.52 U4.P$23
  Bottom 0.203: v32.22,81.52 36.03,81.52 43.14,74.41 52.92,74.41 54.25,73.07 54.63,73.07 55.71,71.99 55.71,70.53 56.73,69.52 J11.P5
ACTL3  (via drill 0.3)
  Top 0.203: U4.P$24 31.83,82.79 33.74,80.88 v33.74,78.34
  Bottom 0.203: v33.74,78.34 35.52,78.34 48.34,65.52 56.79,65.52 57.81,66.53 57.81,67.36 56.73,68.44 55.27,68.44 54.25,69.45 J11.P6
ACTL4  (via drill 0.3)
  Top 0.203: U4.P$25 31.58,84.06 v32.28,83.36
  Bottom 0.203: v32.28,83.36 34.69,83.36 42.44,75.61 54.63,75.61 55.71,74.53 55.71,73.07 56.73,72.06 J11.P7
ACTL5  (via drill 0.3)
  Top 0.203: U4.P$26 31.2,85.33 35.39,81.14 v35.39,80.88
  Bottom 0.203: v35.39,80.88 36.15,80.88 44.6,72.44 53.81,72.44 54.19,72.06 J11.P8
AUX_RX  (via drill 0.3)
  Top 0.203: v50.69,36.88 50.25,37.32 U1.22
  Bottom 0.203: v50.69,36.88 50.31,36.88 46.95,33.51 42.88,33.51 39.77,30.4 36.15,30.4 32.28,26.53 31.64,26.53 27.9,30.27 12.21,30.27 8.28,34.21 J1.P6
AUX_TX  (via drill 0.3)
  Top 0.203: v51.33,37.51 51.33,41.07 50.63,41.77 49.87,41.77 49.49,41.39 49.49,40.81 U1.21
  Bottom 0.203: v51.33,37.51 51.33,36.62 47.84,33.13 43.01,33.13 39.9,30.02 36.28,30.02 32.41,26.14 27.64,26.14 23.9,29.89 11.51,29.89 8.21,33.19 6.75,33.19 5.74,34.21 J1.P4
BL_CTL  (via drill 0.3)  (1 unrouted)
  Top 0.203: v37.55,46.72 39.77,48.94 40.41,48.94 U1.3
  Bottom 0.203: v37.55,46.72 37.36,46.72 24.91,34.27 J13.P10
BLE_CTS  (via drill 0.3)
  Top 0.203: v58.76,88.31 58.76,63.99 53.55,58.78 53.55,50.66 52.66,49.77 52.09,49.77 U1.32 | v55.71,91.36 55.01,91.36 44.41,101.97 44.09,101.97 BLE1.P$3
  Bottom 0.203: v55.71,91.36 v58.76,88.31
BLE_RTS  (via drill 0.3)
  Top 0.203: v54.19,52.88 54.19,50.53 52.66,49.01 52.09,49.01 U1.31 | v53.11,91.81 44.47,100.44 44.09,100.44 BLE1.P$4
  Bottom 0.203: v54.19,52.88 54.19,59.93 58.19,63.93 58.19,86.72 v53.11,91.81
BLE_RX  (via drill 0.3)  (1 unrouted)
  Top 0.203: v27.64,40.24 32.66,40.24 34.95,42.53 40.41,42.53 U1.11 | v45.55,102.35 44.47,103.42 44.09,103.42 BLE1.P$2
  Bottom 0.203: v27.64,40.24 17.99,40.24 16.53,38.78 5.36,38.78 4.66,39.48 4.66,56.37 7.45,59.17 7.45,83.04 22.94,98.53 41.74,98.53 v45.55,102.35
BLE_TX  (via drill 0.3)  (1 unrouted)
  Top 0.203: v38.38,46.66 39.07,47.35 40.41,47.35 U1.5 | v36.85,45.13 34.44,45.13 32.09,47.48 32.09,59.93 30.25,61.77 v30.25,65.52 | v29.74,77.07 29.74,89.45 30.06,89.77 36.72,89.77 42.82,95.87 42.82,104.06 43.71,104.95 44.03,104.95 BLE1.P$1
  Bottom 0.203: v36.85,45.13 v38.38,46.66 | v30.25,65.52 30.25,76.56 v29.74,77.07
BLEGPIO
  Top 0.203: U4.P$5 13.8,73.52 21.8,81.52 27.77,81.52 29.36,83.11 29.36,94.15 30.06,94.85 38.06,94.85 42.44,99.23 42.44,105.2 43.01,105.78 45.55,105.78 56.79,94.53 57.17,94.53 BLE1.P$27
C_INT0  (via drill 0.3)
  Top 0.203: v43.01,53.64 43.01,52.37 U1.43 | v32.22,76.82 32.09,76.82 31.2,77.71 U4.P$20
  Bottom 0.203: v43.01,53.64 43.01,63.17 32.22,73.96 v32.22,76.82
CB0
  Top 0.203: R20.1 46.06,21.89 41.74,26.21 41.74,30.59 42.76,31.61 46.19,31.61 53.11,24.68 53.11,23.99 IC1.23
CB1
  Top 0.203: IC1.22 52.53,23.92 52.53,21.13 54.25,19.41 R21.1
CMCLR
  Top 0.203: 22.56,39.99 21.61,39.99 C10.2 | 22.56,39.99 24.53,39.99 R23.2 24.66,39.99 25.67,38.97 27.26,38.97 28.02,39.73 46.63,39.73 47.01,40.12 47.01,40.75 U1.18 | J10.P1 20.02,42.59 22.56,40.05 22.56,39.99
DCTL0  (via drill 0.3)
  Top 0.203: v32.22,90.41 U4.P$30
  Bottom 0.203: v32.22,90.41 36.91,90.41 45.3,82.03 45.3,81.83 51.14,75.99 55.33,75.99 56.73,74.6 J11.P9
DCTL1  (via drill 0.3)
  Top 0.203: v32.22,91.68 U4.P$31 | v45.93,82.09 46.69,82.09 54.19,74.6 J11.P10
  Bottom 0.203: v32.22,91.68 36.34,91.68 v45.93,82.09
DCTL2  (via drill 0.3)
  Top 0.203: v32.22,92.95 U4.P$32
  Bottom 0.203: v32.22,92.95 34.12,92.95 35.01,92.06 40.34,92.06 54.25,78.15 55.71,78.15 56.73,77.14 J11.P11
DCTL3  (via drill 0.3)
  Top 0.203: U4.P$33 34.69,94.22 v37.49,91.42
  Bottom 0.203: v37.49,91.42 38.82,91.42 53.11,77.14 54.19,77.14 J11.P12
E_U1RX  (via drill 0.3)
  Top 0.203: 47.52,73.52 48.09,74.09 | 48.09,74.09 48.41,74.41 49.87,74.41 50.44,73.83 50.44,68.31 47.27,65.13 47.27,57.45 50.82,53.9 50.82,51.55 44.66,45.39 44.66,40.81 U1.15 | v8.08,82.79 U4.P$62 | 48.09,74.09 v45.93,76.25
  Bottom 0.203: v8.08,82.79 30.82,82.79 32.02,83.99 38.18,83.99 v45.93,76.25
E_U1TX  (via drill 0.3)
  Top 0.203: v43.84,49.64 43.84,40.81 U1.14 | v41.3,63.99 41.3,65.2 47.52,71.42 | U4.P$61 11.51,84.06 v17.23,78.34
  Bottom 0.203: v43.84,49.64 43.52,49.64 41.3,51.86 v41.3,63.99 41.23,64.06 30.82,64.06 29.61,65.26 29.61,65.96 v17.23,78.34
FAN_NEG
  Top 0.203: 23.77,2.84 R7.2 23.64,2.78 | 27.52,2.84 R10.2 27.64,2.84 | 31.33,2.84 R8.2 | 11.58,2.84 R5.2 11.51,2.9 11.45,2.97 | 14.69,2.84 R9.2 14.82,2.84 | 17.86,2.84 R6.2 17.99,2.78
  Top 0.406: 14.7,2.84 R9.2 | 17.88,2.84 R6.2 | 23.71,2.78 R7.2 | 27.53,2.84 R10.2 | 31.34,2.84 R8.2
  Top 0.457: 11.58,2.84 14.7,2.84 | 14.82,2.84 17.88,2.84 | 17.99,2.78 23.71,2.78 | 23.77,2.84 27.53,2.84 | 27.64,2.84 31.34,2.84 | Q1.TAG 5.74,3.09 J2.P2 11.4,2.97 R5.2
FC_A  (via drill 0.3)
  Top 0.203: Q1.P1 8.08,21 8.4,21.32 8.4,25.83 R11.2 8.53,25.89 9.61,26.97 9.61,40.43 15.07,45.89 v15.07,46.85 | v15.07,71.99 U4.P$6
  Bottom 0.203: v15.07,46.85 v15.07,71.99
FC_B  (via drill 0.3)
  Top 0.203: Q2.P1 15.96,21 16.15,21.19 16.15,25.83 R12.2 16.21,25.89 16.21,34.65 17.23,35.67 17.23,40.56 16.34,41.45 v16.34,48.12 | v16.34,71.99 U4.P$7
  Bottom 0.203: v16.34,48.12 v16.34,71.99
FC_C  (via drill 0.3)
  Top 0.203: Q3.P1 23.83,21 24.02,21.19 24.02,25.83 R13.2 23.96,25.89 18.75,31.1 18.75,34.15 17.61,35.29 v17.61,48.75 | v17.61,71.99 U4.P$8
  Bottom 0.203: v17.61,48.75 v17.61,71.99
FL_CLK  (via drill 0.3)
  Top 0.203: v48.47,51.04 48.6,51.16 48.6,52.31 U1.36 | 29.23,51.86 27.71,53.39 26.82,53.39 | 29.23,51.86 30.25,50.85 v30.25,49.58 29.61,48.94 25.8,48.94 25.1,49.64 v20.53,49.64 | 27.45,58.47 27.71,58.47 29.29,56.88 29.29,51.93 29.23,51.86
  Bottom 0.203: v48.47,51.04 46.06,48.62 31.2,48.62 v30.25,49.58 | v20.53,49.64 10.94,40.05 J12.TCK
FL_CS  (via drill 0.3)  (1 unrouted)
  Top 0.203: v50.76,48.18 52.03,48.18 U1.30 | v29.99,48.18 21.04,48.18 18.37,50.85 18.06,50.85 | 18.69,55.93 17.74,55.93 16.91,55.1 16.91,53.58 | 16.91,53.58 16.91,51.67 17.67,50.91 17.99,50.91 | J12.TMS 3.32,40.05 16.85,53.58 16.91,53.58
  Bottom 0.203: v29.99,48.18 v50.76,48.18
FL_MISO  (via drill 0.3)  (1 unrouted)
  Top 0.203: v45.49,47.55 47.01,49.07 47.01,52.31 U1.38 | v29.42,47.55 20.09,47.55 18.06,49.58 | 18.69,54.66 20.02,54.66 v20.66,54.02 | J12.TDO 8.4,41.07 16.85,49.51 17.99,49.51
  Bottom 0.203: v45.49,47.55 45.17,47.55 44.92,47.8 30.5,47.8 30.25,47.55 v29.42,47.55 22.94,54.02 v20.66,54.02
FL_MOSI  (via drill 0.3)
  Top 0.203: v47.65,51.1 47.84,51.29 47.84,52.31 U1.37 | v29.61,50.21 27.71,52.12 26.82,52.12
  Bottom 0.203: v47.65,51.1 47.14,51.1 45.04,49.01 31.71,49.01 30.5,50.21 v29.61,50.21 25.17,54.66 20.4,54.66 20.02,54.28 20.02,50.28 15.96,46.21 12.85,46.21 6.69,40.05 5.86,40.05 J12.TDI
FT_CTS  (via drill 0.3)  (1 unrouted)
  Top 0.203: v43.07,42.02 43.07,40.81 U1.13 | v45.99,39.1 45.99,38.47 49.87,34.59 49.87,31.29 IC1.11
  Bottom 0.203: v45.99,39.1 v43.07,42.02
FT_RTS  (1 unrouted)
FT_RX  (1 unrouted)
  Top 0.203: U1.20 48.66,40.75 48.66,37.07 53.74,31.99 53.74,31.29 IC1.5
FT_TX  (via drill 0.3)  (1 unrouted)
  Top 0.203: v49.3,37.77 49.3,37.38 50.44,36.24 52.09,36.24 56.35,31.99 56.35,31.29 IC1.1 | v48.03,39.04 48.03,40.62 47.9,40.75 U1.19
  Bottom 0.203: v48.03,39.04 v49.3,37.77
GND  (via drill 0.3)  (74 unrouted)
  Top 0.203: R14.1 30.19,25.89 v27.45,28.62 | 27.07,21 Q4.P3 | 34.76,21 Q5.P3 | 27.83,21.64 Q4.P3 | R12.1 | 11.32,21 Q2.P3 12.09,21.64 | R13.1 19.83,25.83 v19.2,25.19 | 19.2,21 Q3.P3 | 19.14,20.94 Q3.P3 | 26.88,20.94 27.01,20.94 Q4.P3 | 19.96,21.64 Q3.P3 | C6.1 v26.88,69.83 26.88,71.36 25.87,72.37 25.87,74.15 26.88,75.17 U4.P$18 31.01,75.23 31.52,75.23 39.26,82.98 39.26,83.99 C7.1 | 48.44,44.34 51.46,47.35 52.03,47.35 U1.29 52.15,47.35 53.04,47.35 53.27,47.13 | 48.44,44.34 45.49,41.39 45.49,40.81 U1.16 | 53.27,47.13 54.82,45.58 56.92,45.58 C13.1 | 53.27,47.13 C12.1 56.66,50.66 54.82,52.5 54.82,56.24 C3.1 | R11.1 | Q1.P3 | 6.56,72.18 7.64,73.26 U4.P$1 | 6.56,72.18 3,68.63 2.88,68.63 C2.1 | IC1.25 IC1.26 55.08,24.05 52.53,26.59 v52.53,28.94 52.53,31.23 IC1.7 | BLE1.P$22 57.17,86.92 55.84,85.58 55.84,85.14 BLE1.P$21 55.9,85.07 55.9,80.5 56.73,79.68 J11.P13 | BLE1.P$13 44.09,86.92 45.3,85.71 45.3,85.14 BLE1.P$14 45.3,85.07 45.3,73.64 45.42,73.52 | 50.19,22.97 49.93,23.22 49.93,23.92 IC1.18 | 50.19,22.97 51.52,22.97 51.77,23.22 51.77,23.92 IC1.21 | v19.71,41.26 19.71,40.05 C10.1 | C9.1 31.14,48.31 28.22,45.39 26.12,45.39 25.1,44.37 J10.P3 | J3.P2 3.26,49.45 7.13,49.45 R2.1 | J3.P2 | v35.9,37.96 C5.1 | 34.12,62.15 34.12,58.66 37.61,55.16 C4.1 | v37.87,27.1 R3.1 | C11.1 43.2,32.88 42.12,32.88 39.71,35.29 35.26,35.29 34.25,34.27 J9.P2 | v44.6,30.97 44.6,29.77 R22.1 | v39.2,46.59 40.41,46.59 U1.6 | v46.25,51.1 U1.39 | J5.P2 10.25,66.85 C1.1 10.18,68.56 6.56,72.18 | J5.P2 | C8.1 48.22,58.78 48.6,58.78 54.19,64.37 J11.P2 | 6.82,98.98 U4.P$52 | 29.04,98.98 U4.P$35 | v50.19,22.72 50.19,22.97 | R11.1 6.62,25.89 6.62,30.02 8.28,31.67 J1.P5
  Top 0.203: v48.41,44.37 48.44,44.34 | R12.1 14.25,25.89 14.25,30.27 13.67,30.84 13.67,33.19 14.69,34.21 J13.P2 | R11.1 4.21,25.83 v3.45,25.07 | R12.1 12.09,25.83 v11.32,25.07
  Top 0.457: Q1.P3 3.45,24.18 | v4.21,24.18 3.45,24.18 | 3.45,24.18 v3.45,25.07 | 11.32,21 11.32,24.18 | v11.96,24.18 11.32,24.18 | 11.32,24.18 v11.32,25.07 | 19.2,21 19.2,24.3 | v19.83,24.3 19.2,24.3 | 19.2,24.3 v19.2,25.19 | 26.88,20.94 26.88,22.46 26.82,22.53 26.82,24.05 | 26.82,24.05 26.82,24.18 | 26.82,24.18 26.95,24.18 | v27.33,24.18 26.95,24.18 | 26.95,24.18 26.82,24.05 | 26.82,24.18 26.82,27.99 v27.45,28.62 | Q5.P3 34.8,22.39 34.82,22.4 v34.82,24.3
  Top 0.462: ANT1.P$2 15.61,105.36 15.64,105.33
  other vias: 3.45,105.33 25.04,105.33 22.5,105.33 22.5,100.25 25.04,100.25 27.58,100.25 30.12,100.25 32.66,100.25 35.2,100.25 37.74,100.25 40.28,100.25 40.28,102.79 40.28,105.33 37.74,105.33 35.2,105.33 32.66,105.33 30.12,105.33 27.58,105.33 14.12,105.33 14.12,100.25 8.53,105.33 11.07,105.33 11.07,100.25 8.53,100.25 5.99,100.25 5.99,105.33 3.45,100.25 3.45,102.79 17.42,105.33 17.42,102.79 17.42,100.25 20.47,105.33 20.47,100.25 20.47,102.79
  pour Route2: 0.91,105.33 60.6,105.33 60.6,-0.08 0.91,-0.08
  pour Top (no thermals): 0.91,106.24 17.17,106.24 17.17,106.68 18.06,106.68 18.06,98.7 17.88,98.52 17.83,97.51 17.39,97.51 17.37,98.47 16.81,98.98 0.91,98.98
  pour Top (no thermals): 19.71,106.24 19.73,98.65 19.93,98.47 19.93,97.79 20.39,97.79 20.39,98.6 20.77,98.98 41.55,98.98 41.52,106.24
  pour Bottom: 0.91,106.24 41.55,106.24 41.55,98.98 0.91,98.98
HC  (via drill 0.3)  (1 unrouted)
  Top 0.203: Q4.P1 31.71,21 32.02,21.32 32.02,25.83 R14.2 32.02,25.89 v32.02,27.16 | v36.79,47.16 39.33,49.7 40.41,49.7 U1.2
  Bottom 0.203: v36.79,47.16 37.1,47.16 37.3,47.35 39.33,47.35 39.84,46.85 39.84,42.78 32.41,35.35 32.41,27.54 v32.02,27.16
HEAT_NEG
  Top 0.203: 29.36,12.37 Q4.TAG
  Top 0.457: J6.P2 39.37,3.5 37.87,5 35.71,5 31.14,9.57 31.14,10.62 Q4.TAG
L_SPI_CLK  (via drill 0.3)
  Top 0.203: v53.11,36.5 53.11,43.67 52.66,44.12 52.09,44.12 U1.25 | v21.86,27.1 17.29,31.67 J13.P3
  Bottom 0.203: v53.11,36.5 52.73,36.5 41.61,25.38 23.58,25.38 v21.86,27.1
L_SPI_LCD_CS  (via drill 0.3)
  Top 0.203: v50.76,42.53 52.03,42.53 U1.23 | v44.98,36.05 31.52,36.05 28.15,32.69 23.33,32.69 22.37,31.73 J13.P7
  Bottom 0.203: v50.76,42.53 50.63,42.53 47.01,38.91 47.01,38.08 v44.98,36.05
L_SPI_MISO  (via drill 0.3)
  Top 0.203: v53.3,45.7 52.09,45.7 U1.27 | v23.96,27.54 19.83,31.67 J13.P5
  Bottom 0.203: v53.3,45.7 53.3,38.08 44.47,29.26 36.03,29.26 32.53,25.77 25.74,25.77 v23.96,27.54
L_SPI_MOSI  (via drill 0.3)
  Top 0.203: v53.93,44.94 52.09,44.94 U1.26 | v40.66,28.62 32.34,28.62 v31.77,29.19
  Bottom 0.203: v53.93,44.94 53.93,38.21 44.34,28.62 v40.66,28.62 | v31.77,29.19 29.48,29.19 28.02,30.65 19.33,30.65 18.31,31.67 18.31,33.19 17.29,34.21 J13.P4
L_SPI_TP_CS  (via drill 0.3)
  Top 0.203: v50.76,43.35 52.03,43.35 U1.24 | v46.25,36.43 45.49,36.43 45.23,36.69 40.34,36.69 40.09,36.43 31.39,36.43 30.18,35.23 20.78,35.23 19.83,34.27 J13.P6
  Bottom 0.203: v50.76,43.35 50.95,43.16 51.01,43.16 51.39,42.78 51.39,38.97 48.85,36.43 v46.25,36.43
LCD_EN  (via drill 0.3)
  Top 0.203: Q5.P1 39.45,21 39.71,21.26 39.71,25.83 R3.2 39.84,25.89 41.3,27.35 v41.3,32.81 | v44.66,47.16 44.66,52.31 U1.41
  Bottom 0.203: v44.66,47.16 44.66,41.32 46.63,39.35 46.63,38.59 42.57,34.53 42.57,34.08 v41.3,32.81
LCD_GFX_CS  (1 unrouted)
LCD_GND
  Top 0.203: Q5.TAG 37.1,23.8 33.04,27.86 31.52,27.86 30.63,28.75 30.63,29.45 28.41,31.67 27.45,31.67 J13.P11
LCD_RST  (via drill 0.3)
  Top 0.203: v35.14,46.91 42.5,54.28 48.15,54.28 49.42,53.01 49.42,52.37 U1.35
  Bottom 0.203: v35.14,46.91 33.87,46.91 31.2,44.24 31.2,42.02 23.83,34.65 23.83,32.75 24.85,31.73 J13.P9
LCD_WR  (1 unrouted)
N$1
  Top 0.203: U1.7 40.41,45.77 35.26,45.77 33.04,47.99 33.04,48.31 C9.2
N$2  (1 unrouted)
N$3
  Top 0.462: ANT1.P$1 18.89,97.4 U4.P$43
N$4  (1 unrouted)
N$5  (1 unrouted)
N$6
  Top 0.203: 17.86,5.7 R6.1 | 14.82,5.7 R9.1
  Top 0.457: 17.86,5.7 14.77,5.7 | 14.77,5.7 R9.1 | 14.77,5.7 13.48,5.7 | 13.48,5.7 11.59,5.7 R5.1 | Q2.TAG 13.61,5.83 13.48,5.7
N$7
  Top 0.203: 23.77,5.7 R7.1 23.71,5.76 | 27.52,5.7 R10.1 27.64,5.7 | 31.33,5.7 R8.1 | 23.71,10.14 21.48,12.37 Q3.TAG
  Top 0.457: 23.71,10.14 23.71,5.7 R7.1 | 23.77,5.7 27.52,5.7 R10.1 | 27.64,5.7 31.33,5.7 R8.1
N$8  (1 unrouted)
N$9
  Top 0.203: D4.C 48.73,16.94 48.73,18.46 R20.2
N$10
  Top 0.203: D1.C 15.39,65.39 15.39,67.74 R16.2
N$11
  Top 0.203: D2.C 21.04,65.39 21.04,67.74 R17.2
N$12
  Top 0.203: D3.C 17.99,65.39 17.99,67.74 R18.2
N$13
  Top 0.203: U4.P$65 7.07,78.98 10.63,75.42 10.63,72.37 13.29,69.71 15.33,69.71 R16.1
N$14
  Top 0.203: D5.C 56.47,16.94 56.47,19.1 56.22,19.35 R21.2
N$15
  Top 0.203: U4.P$66 6.56,77.71 5.8,78.47 5.8,79.49 5.93,79.61 7.7,79.61 13.17,74.15 13.17,72.37 14.18,71.36 18.12,71.36 19.77,69.71 20.98,69.71 R17.1
N$16
  Top 0.203: U4.P$67 7.07,76.44 9.36,74.15 9.36,72.37 12.97,68.75 16.21,68.75 17.1,69.64 17.93,69.64 R18.1
N$17  (1 unrouted)
N$19
  Top 0.203: IC1.19 50.5,23.99 50.5,24.68 49.36,25.83 43.96,25.83 42.76,27.04 R24.1 42.69,27.1 42.69,29.7 R22.2
N$23
  Top 0.203: R2.2 9.04,49.45 9.04,52.31 R1.1 9.1,52.37 15.83,59.1 19.39,59.1 22.06,61.77 22.06,74.15 24.34,76.44 U4.P$19
PD0  (1 unrouted)
PD1  (1 unrouted)
PD2  (1 unrouted)
PD3  (1 unrouted)
PD4  (1 unrouted)
PD5  (1 unrouted)
PD6  (1 unrouted)
PD7  (1 unrouted)
PD8  (1 unrouted)
PD9  (1 unrouted)
PD10  (1 unrouted)
PD11  (1 unrouted)
PD12  (1 unrouted)
PD13  (1 unrouted)
PD14  (1 unrouted)
PD15  (1 unrouted)
PGC
  Top 0.203: U1.9 40.41,44.12 33.93,44.12 33.1,43.29 31.2,43.29 30.18,44.31 J10.P5
PGD
  Top 0.203: U1.8 40.41,44.94 37.55,44.94 37.1,44.5 33.99,44.5 33.1,45.39 28.72,45.39 27.64,44.31 J10.P4
RESETB  (via drill 0.3)  (1 unrouted)
  Top 0.203: v50.19,53.64 50.19,52.37 U1.34 | v39.9,67.17 38.25,68.82 R15.2 40.34,70.98 40.34,87.11 43.2,89.96 44.03,89.96 BLE1.P$11
  Bottom 0.203: v50.19,53.64 50.19,56.88 v39.9,67.17
RH_AN0  (1 unrouted)
RH_AN1  (1 unrouted)
RH_CLK  (via drill 0.3)  (1 unrouted)
  Top 0.203: v42.25,47.16 42.25,52.31 U1.44
  Bottom 0.203: v42.25,47.16 42.25,35.92 40.34,34.02 40.34,32.75 39.33,31.73 J9.P5
RH_DAT  (via drill 0.3)  (1 unrouted)
  Top 0.203: v41.49,41.89 41.49,50.09 41.04,50.53 40.47,50.53 U1.1
  Bottom 0.203: v41.49,41.89 41.49,36.43 39.33,34.27 J9.P6
RST
  Top 0.203: C8.2 46.31,58.78 46.31,62.15 R4.2 46.19,62.15 44.98,63.36 | U4.P$16 27.77,72.5 36.91,63.36 44.98,63.36 | 49.42,73.45 49.42,72.75 48.41,71.74 48.41,66.78 44.98,63.36
SPI_CLK  (1 unrouted)
SPI_MISO  (1 unrouted)
SPI_MOSI  (1 unrouted)
SYSKEY  (via drill 0.3)
  Top 0.203: v43.71,50.91 43.2,50.4 43.2,47.23 42.31,46.34 42.31,40.81 U1.12 | v49.49,56.69 50.95,56.69 58.38,64.12 58.38,87.61 57.55,88.44 57.17,88.44 BLE1.P$23
  Bottom 0.203: v49.49,56.69 v43.71,50.91
TCK  (via drill 0.3)
  Top 0.203: 31.52,62.15 31.52,67.67 26.5,72.69 U4.P$15 26.56,73.33 26.56,73.58 27.26,74.28 28.28,74.28 28.41,74.15 28.41,72.37 34.25,66.53 40.15,66.53 43.9,70.28 v45.49,70.28
  Bottom 0.203: 49.42,71.42 48.79,71.42 47.65,70.28 v45.49,70.28
TDI  (via drill 0.3)
  Top 0.203: v23.96,66.4 U4.P$13
  Bottom 0.203: v23.96,66.4 23.96,64.63 26.44,62.15
TDO  (via drill 0.3)
  Top 0.203: v22.69,71.99 U4.P$12
  Bottom 0.203: v22.69,71.99 22.69,68.56 28.98,62.28 28.98,62.15
TMS
  Top 0.203: U4.P$14 25.23,63.42 23.96,62.15
TP_CLK  (1 unrouted)
TP_CS  (1 unrouted)
TP_IRQ  (via drill 0.3)  (2 unrouted)
  Top 0.203: v52.03,51.35 52.03,50.59 U1.33 | v27.52,82.15 27.52,94.85 25.23,97.14 U4.P$38 | v23.96,35.86 30.31,35.86 31.39,36.94 40.09,36.94 40.22,37.07 46.5,37.07 v47.77,35.8
  Bottom 0.203: v27.52,82.15 27.77,82.15 52.03,57.9 v52.03,51.35 51.96,51.29 51.96,39.04 48.73,35.8 v47.77,35.8 | v23.96,35.86 22.37,34.27 J13.P8
TP_MISO  (1 unrouted)
TP_MOSI  (1 unrouted)
USBD_N
  Top 0.203: IC1.16 48.58,22.61 50.74,20.44 50.74,19.62 arc90 51.04,19.33 51.13,19.33 arc-90 51.42,19.03 51.42,18.86 arc-90 51.13,18.57 51.04,18.57 arc90 50.74,18.27 50.74,18.1 arc90 51.04,17.81 51.13,17.81 arc-90 51.42,17.52 51.42,17.34 arc-90 51.13,17.05 51.04,17.05 arc90 50.74,16.76 50.74,16.61 48.33,14.2 48.33,13.59 48.79,13.13 49.54,13.13 U$1.2_D-
USBD_P
  Top 0.203: IC1.15 47.93,22.75 50.39,20.29 50.39,16.76 47.98,14.35 47.98,12.82 U$1.3_D+

### Text on the board
Top: M ANDERSEN (C) 2013 | PECS CTL 2.0 | PECS CTL 2.0
tPlace: UC BERKELEY | EPIC | ICSP | FLASH | + | + | FAN | HEAT
tStop: M ANDERSEN (C) 2013 | PECS CTL 2.0